# EAGLE design Gimbal Controller Board (EAGLE 8.4.1)

## Sheet 1 of 2
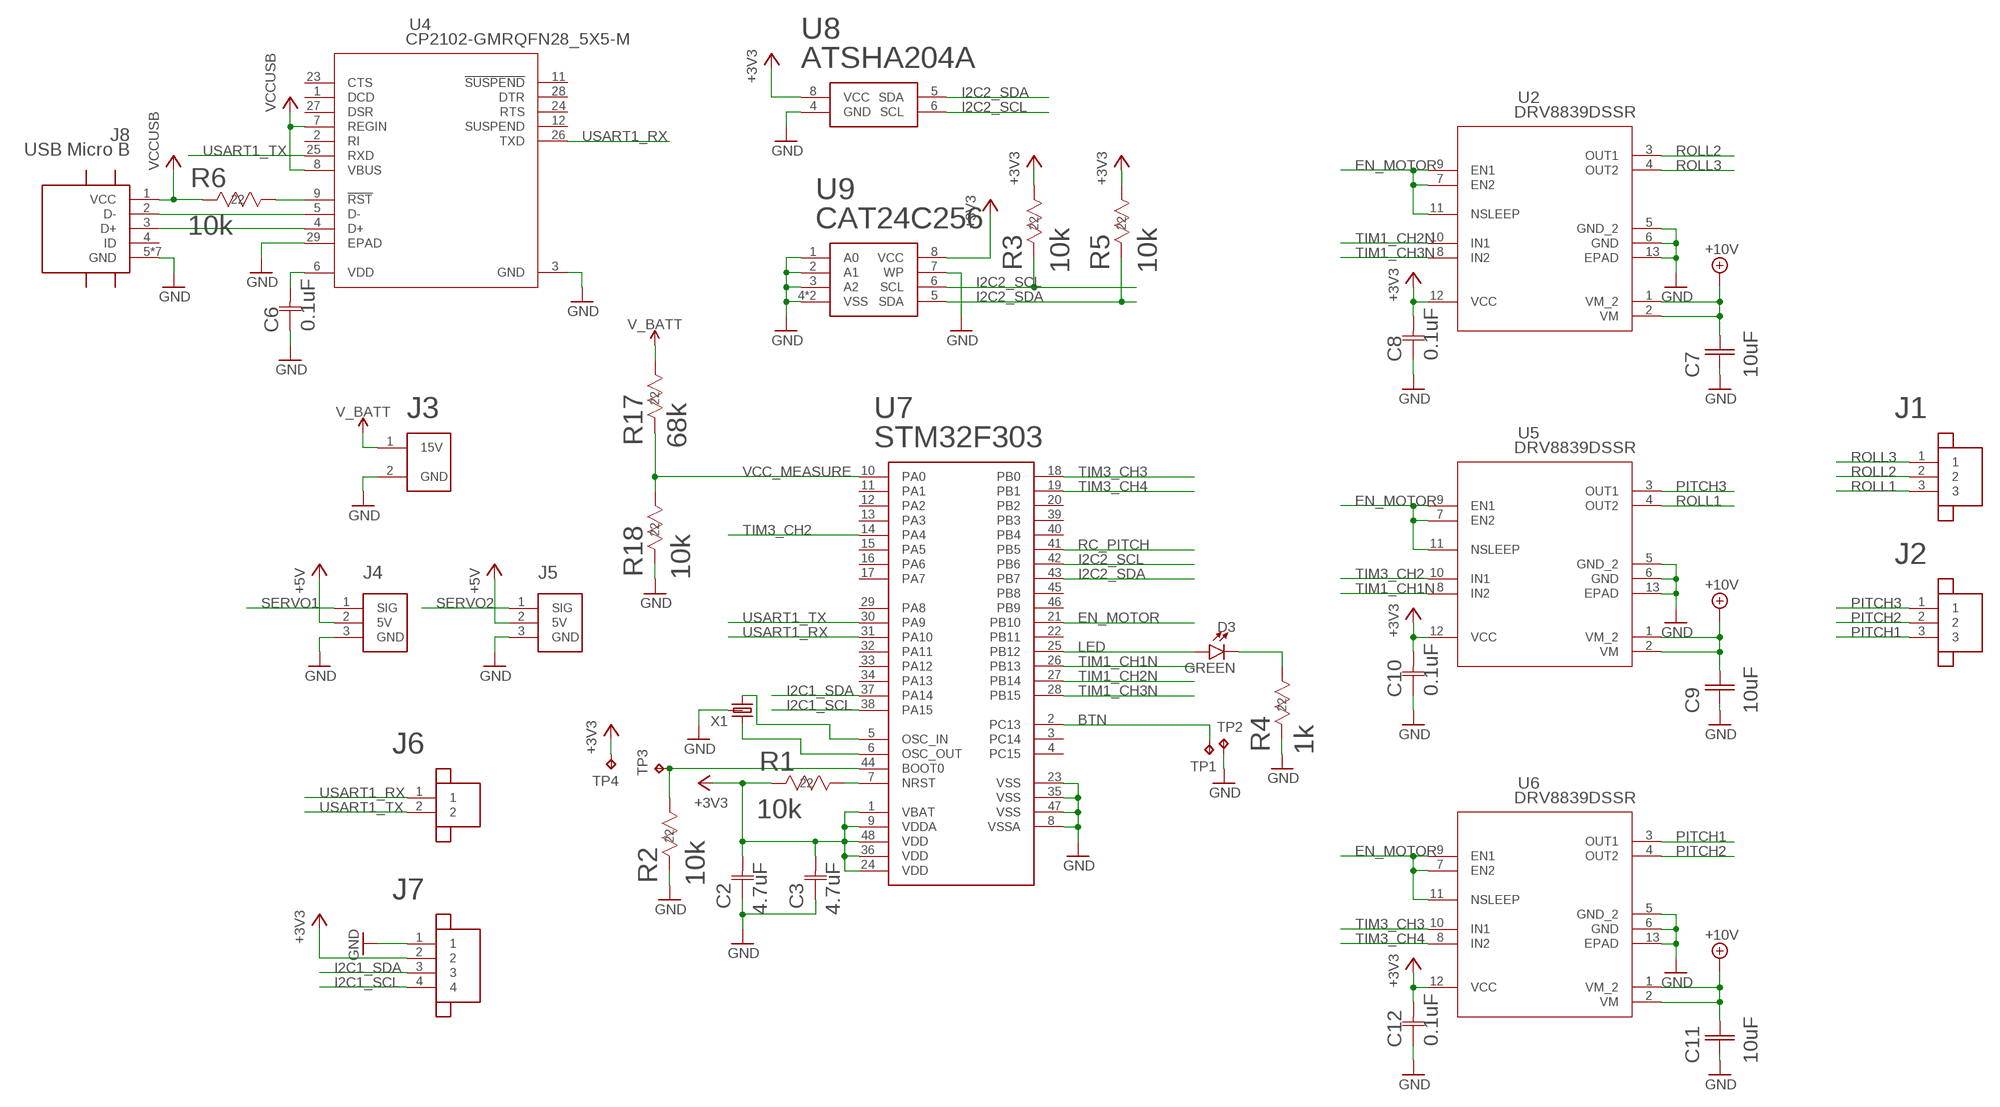
[diagram p0: schematic, sheet 1]

### Parts
C2  4.7uF  06036D475KAT2A0603-M  [0603-M]
C3  4.7uF  06036D475KAT2A0603-M  [0603-M]
C6  0.1uF  0402ZD104KAT2A0402-M  [0402-M]
C7  10uF  10UF_CAPACITOR  [0805_CAPACITOR]
C8  0.1uF  0402ZD104KAT2A0402-M  [0402-M]
C9  10uF  10UF_CAPACITOR  [0805_CAPACITOR]
C10  0.1uF  0402ZD104KAT2A0402-M  [0402-M]
C11  10uF  10UF_CAPACITOR  [0805_CAPACITOR]
C12  0.1uF  0402ZD104KAT2A0402-M  [0402-M]
D3  GREEN  LED-GREEN0603  [LED-0603]
J1  JST_SH_3POS  [JST_SH_3POS]
J2  JST_SH_3POS  [JST_SH_3POS]
J3  GIMBAL_POWER_CONNECTOR  [XH_CONNECTOR]
J4  SERVO_CONNECTOR  [SERVO_CONNECTOR]
J5  SERVO_CONNECTOR  [SERVO_CONNECTOR]
J6  JST_SH_2POS  [JST_SH_2POS]
J7  JST_SH_4POS  [JST_SH_4POS]
J8  USB_MICRO_B_SMT  [USB_MICRO_B_SMT]
R1  10k  ERA-6AEB103V  [RC0805N]
R2  10k  ERA-6AEB103V  [RC0805N]
R3  10k  ERA-6AEB103V  [RC0805N]
R4  1k  RC0603JR-071KLRC0603N-M  [RC0603N-M]
R5  10k  ERA-6AEB103V  [RC0805N]
R6  10k  ERA-6AEB103V  [RC0805N]
R17  68k  RC0402FR-0768KLRC0402N-M  [RC0402N-M]
R18  10k  ERA-6AEB103V  [RC0805N]
TP1  TPB2,54  [B2,54]
TP2  TPB2,54  [B2,54]
TP3  TPB2,54  [B2,54]
TP4  TPB2,54  [B2,54]
U2  DRV8839DSSR  [DSS12_P9X2]
U4  CP2102-GMRQFN28_5X5-M  [QFN28_5X5-M]
U5  DRV8839DSSR  [DSS12_P9X2]
U6  DRV8839DSSR  [DSS12_P9X2]
U7  STM32F303  [LQFP48]
U8  ATSHA204A  [UDFN8_3X2]
U9  CAT24C256  [UDFN8_3X2]
X1  CSTCE8M00G55Z  [3-SMD]

### Nets
+3V3: C2.2 C3.2 C8.2 C10.2 C12.2 J7.2 R1.2 R3.1 R5.1 TP4.TP U2.12(VCC) U5.12(VCC) U6.12(VCC) U7.1(VBAT) U7.9(VDDA) U7.24(VDD) U7.36(VDD) U7.48(VDD) U8.8(VCC) U9.8(VCC) ; also sheet 2
+5V: J4.2(5V) J5.2(5V) ; also sheet 2
+10V: C7.2 C9.2 C11.2 U2.1(VM_2) U2.2(VM) U5.1(VM_2) U5.2(VM) U6.1(VM_2) U6.2(VM) ; also sheet 2
BTN: TP1.TP U7.2(PC13)
EN_MOTOR: U2.7(EN2) U2.9(EN1) U2.11(NSLEEP) U5.7(EN2) U5.9(EN1) U5.11(NSLEEP) U6.7(EN2) U6.9(EN1) U6.11(NSLEEP) U7.21(PB10)
GND: C2.1 C3.1 C6.1 C7.1 C8.1 C9.1 C10.1 C11.1 C12.1 J3.2(GND) J4.3(GND) J5.3(GND) J7.1 J8.5(GND) J8.6(GND) J8.7(GND) J8.P$1(GND) J8.P$2(GND) J8.P$3(GND) J8.P$4(GND) R2.2 R4.2 R18.2 TP2.TP U2.5(GND_2) U2.6(GND) U2.13(EPAD) U4.3(GND) U4.29(EPAD) U5.5(GND_2) U5.6(GND) U5.13(EPAD) U6.5(GND_2) U6.6(GND) U6.13(EPAD) U7.8(VSSA) U7.23(VSS) U7.35(VSS) U7.47(VSS) U8.4(GND) U9.1(A0) U9.2(A1) U9.3(A2) U9.4(VSS) U9.7(WP) U9.9(VSS) X1.2(GND) ; also sheet 2
I2C1_SCL: J7.4 U7.38(PA15)
I2C1_SDA: J7.3 U7.37(PA14)
I2C2_SCL: R3.2 U7.42(PB6) U8.6(SCL) U9.6(SCL)
I2C2_SDA: R5.2 U7.43(PB7) U8.5(SDA) U9.5(SDA)
LED: D3.A U7.25(PB12)
N$2: U7.5(OSC_IN) X1.3
N$4: R1.1 U7.7(NRST)
N$5: D3.C R4.1
N$6: R2.1 TP3.TP U7.44(BOOT0)
N$7: J8.2(D-) U4.5(D-)
N$8: J8.3(D+) U4.4(D+)
N$9: R6.1 U4.9(!RST)
N$10: C6.2 U4.6(VDD)
N$24: U7.6(OSC_OUT) X1.1
P$1: J8.1(VCC) R6.2 U4.7(REGIN) U4.8(VBUS) ; supply symbol labelled VCCUSB
PITCH1: J2.3 U6.3(OUT1)
PITCH2: J2.2 U6.4(OUT2)
PITCH3: J2.1 U5.3(OUT1)
RC_PITCH: U7.41(PB5)
ROLL1: J1.3 U5.4(OUT2)
ROLL2: J1.2 U2.3(OUT1)
ROLL3: J1.1 U2.4(OUT2)
SERVO1: J4.1(SIG)
SERVO2: J5.1(SIG)
TIM1_CH1N: U5.8(IN2) U7.26(PB13)
TIM1_CH2N: U2.10(IN1) U7.27(PB14)
TIM1_CH3N: U2.8(IN2) U7.28(PB15)
TIM3_CH2: U5.10(IN1) U7.14(PA4)
TIM3_CH3: U6.10(IN1) U7.18(PB0)
TIM3_CH4: U6.8(IN2) U7.19(PB1)
USART1_RX: J6.1 U4.26(TXD) U7.31(PA10)
USART1_TX: J6.2 U4.25(RXD) U7.30(PA9)
V_BATT: J3.1(15V) R17.1 ; also sheet 2
VCC_MEASURE: R17.2 R18.1 U7.10(PA0)
Unconnected: J8.4(ID) U4.1(DCD) U4.2(RI) U4.11(!SUSPEND) U4.12(SUSPEND) U4.23(CTS) U4.24(RTS) U4.27(DSR) U4.28(DTR) U7.3(PC14) U7.4(PC15) U7.11(PA1) U7.12(PA2) U7.13(PA3) U7.15(PA5) U7.16(PA6) U7.17(PA7) U7.20(PB2) U7.22(PB11) U7.29(PA8) U7.32(PA11) U7.33(PA12) U7.34(PA13) U7.39(PB3) U7.40(PB4) U7.45(PB8) U7.46(PB9)

## Sheet 2 of 2
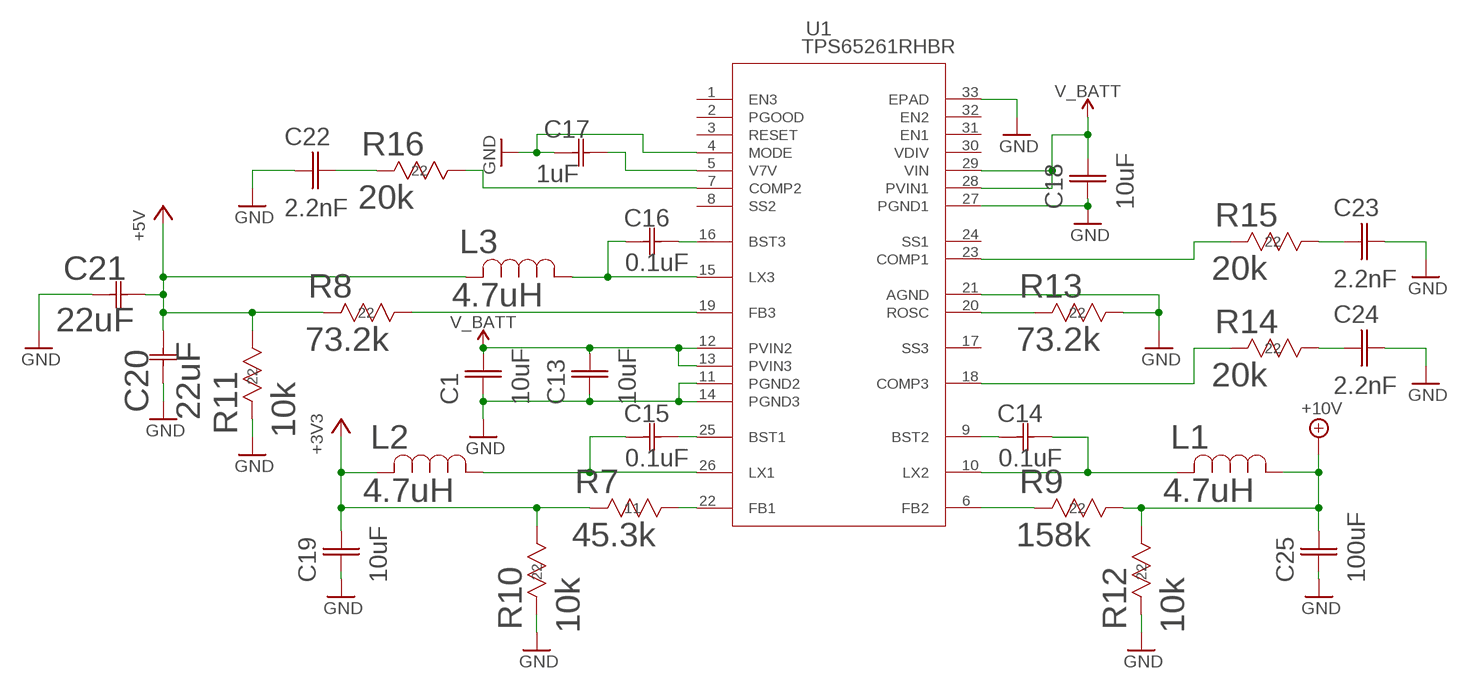
[diagram p1: schematic, sheet 2]

### Parts
C1  10uF  10UF_CAPACITOR  [0805_CAPACITOR]
C13  10uF  10UF_CAPACITOR  [0805_CAPACITOR]
C14  0.1uF  0402ZD104KAT2A0402-M  [0402-M]
C15  0.1uF  0402ZD104KAT2A0402-M  [0402-M]
C16  0.1uF  0402ZD104KAT2A0402-M  [0402-M]
C17  1uF  CC0805KKX7R7BB105  [YAG_CC0805]
C18  10uF  10UF_CAPACITOR  [0805_CAPACITOR]
C19  10uF  10UF_CAPACITOR  [0805_CAPACITOR]
C20  22uF  GRM21BR60J226ME39L  [G-21]
C21  22uF  GRM21BR60J226ME39L  [G-21]
C22  2.2nF  2200PF_CAPACITOR  [0402_CAPACITOR]
C23  2.2nF  2200PF_CAPACITOR  [0402_CAPACITOR]
C24  2.2nF  2200PF_CAPACITOR  [0402_CAPACITOR]
C25  100uF  100UF_CER_CAPACITOR  [1210_CAPACITOR]
L1  4.7uH  DFE252012P-4R7M=P2"  [1008]
L2  4.7uH  DFE252012P-4R7M=P2"  [1008]
L3  4.7uH  DFE252012P-4R7M=P2"  [1008]
R7  45.3k  RMCF0402FT73K2STA_RMCF0402-M  [STA_RMCF0402-M]
R8  73.2k  RC0402FR-0745K3LRC0402N-M  [RC0402N-M]
R9  158k  RC0402FR-07150KLRC0402N-M  [RC0402N-M]
R10  10k  ERA-6AEB103V  [RC0805N]
R11  10k  ERA-6AEB103V  [RC0805N]
R12  10k  ERA-6AEB103V  [RC0805N]
R13  73.2k  RC0402FR-0745K3LRC0402N-M  [RC0402N-M]
R14  20k  RC0402FR-0720KLRC0402N-M  [RC0402N-M]
R15  20k  RC0402FR-0720KLRC0402N-M  [RC0402N-M]
R16  20k  RC0402FR-0720KLRC0402N-M  [RC0402N-M]
U1  TPS65261RHBR  [RHB32_3P45X3P45]

### Nets
+3V3: C19.2 L2.P$2 R7.1 R10.1 ; also sheet 1
+5V: C20.2 C21.2 L3.P$2 R8.2 R11.1 ; also sheet 1
+10V: C25.2 L1.P$1 R9.1 R12.1 ; also sheet 1
GND: C1.1 C13.1 C17.1 C18.1 C19.1 C20.1 C21.1 C22.1 C23.2 C24.2 C25.1 R10.2 R11.2 R12.2 R13.1 U1.4(MODE) U1.11(PGND2) U1.14(PGND3) U1.21(AGND) U1.27(PGND1) U1.33(EPAD) ; also sheet 1
N$1: C16.2 U1.16(BST3)
N$3: R8.1 U1.19(FB3)
N$11: C14.1 U1.9(BST2)
N$12: R14.2 U1.18(COMP3)
N$13: R9.2 U1.6(FB2)
N$14: R13.2 U1.20(ROSC)
N$15: C15.1 L2.P$1 U1.26(LX1)
N$16: C15.2 U1.25(BST1)
N$17: R7.2 U1.22(FB1)
N$18: C24.1 R14.1
N$19: C16.1 L3.P$1 U1.15(LX3)
N$20: C14.2 L1.P$2 U1.10(LX2)
N$23: C17.2 U1.5(V7V)
N$26: R16.1 U1.7(COMP2)
N$27: C22.2 R16.2
N$28: R15.2 U1.23(COMP1)
N$29: C23.1 R15.1
V_BATT: C1.2 C13.2 C18.2 U1.12(PVIN2) U1.13(PVIN3) U1.28(PVIN1) U1.29(VIN) ; also sheet 1
Unconnected: U1.1(EN3) U1.2(PGOOD) U1.3(RESET) U1.8(SS2) U1.17(SS3) U1.24(SS1) U1.30(VDIV) U1.31(EN1) U1.32(EN2)

## Library data of the parts
C1 C7 C9 C11 C13 C18 C19 = thanics_robotics:10UF_CAPACITOR
C2 C3 = 4.7uF-capacitor:06036D475KAT2A; MANUFACTURER_PART_NUMBER: 06036D475KAT2A; VENDOR: AVX Corporation
C6 C8 C10 C12 C14-C16 = 0.1uF-capacitor-0402:0402ZD104KAT2A; MANUFACTURER_PART_NUMBER: 0402ZD104KAT2A; VENDOR: AVX Corporation
C17 = 1uF X7R Ceramic Capacitor:CC0805KKX7R7BB105; COPYRIGHT: Copyright C 2015 Accelerated Designs. All rights reserved; MANUFACTURER_PART_NUMBER: CC0805KKX7R7BB105; VENDOR: Vendor
C20 C21 = 22uF X5R Ceramic Capacitor:GRM21BR60J226ME39L; COPYRIGHT: Copyright C 2015 Accelerated Designs. All rights reserved; MANUFACTURER_PART_NUMBER: GRM21BR60J226ME39L; VENDOR: Vendor
C22-C24 = thanics_robotics:2200PF_CAPACITOR
C25 = thanics_robotics:100UF_CER_CAPACITOR
D3 = Controller Board:LED-GREEN: Green SMD LED Used in manufacturing of various products at SparkFun Packages: 0603 - SMD 0603 package [Product Link] <http://www.futureelectronics.com/en/technologies/semiconductors/optoelectronics/leds/Pages/9894312-LTST-C190GKT.aspx?CrossPart=HSMG-C190&IM=0> LilyPad 1206 - SMD1206 LilyPad package [Product Link] <http://www.futureelectronics.com/en/Technologies/Product.aspx?ProductID=IN150NGHARVATEKCORPORATION2049943&IM=0> 1206 - SMD1206 package [Product Link] <http://www.futureelectronics.com/en/technologies/semiconductors/optoelectronics/leds/Pages/8315665-LTST-C150KGKT.aspx?IM=0> 1206 Bottom Mount -SMD 1206 Bottom Mount [Product Link] <http://www.digikey.com/product-detail/en/lite-on-inc/LTST-C230KGKT/160-1456-1-ND/386854> SparkFun Products: Pro Mini 328 -5V <https://www.sparkfun.com/products/821> RedBoard <https://www.sparkfun.com/products/12757> MP3 Trigger <https://www.sparkfun.com/products/13720> Makey Makey <https://www.sparkfun.com/products/11076>; PROD_ID: DIO-00821
J1 J2 = thanics_robotics:JST_SH_3POS
J3 = thanics_robotics:GIMBAL_POWER_CONNECTOR
J4 J5 = thanics_robotics:SERVO_CONNECTOR
J6 = thanics_robotics:JST_SH_2POS
J7 = thanics_robotics:JST_SH_4POS
J8 = thanics_robotics:USB_MICRO_B_SMT
L1-L3 = 4.7uH-inductor:DFE252012P-4R7M=P2
R1-R3 R5 R6 R10-R12 R18 = 10k-resistor:ERA-6AEB103V; CASE: 0805 2012 metric; COMPOSITION: Thin Film; COPYRIGHT: Copyright C 2015 Accelerated Designs. All rights reserved; DATASHEET: httpindustrial.panasonic.comwwwcgijvcr13pz.cgi?E+PZ+3+AOA0026+ERA6AEB103V+7+WW; DIGIKEYPARTNUMBER: P10KDATRND; HEIGHT: 0.024" 0.60mm; LEADSTYLE: Surface Mount SMD SMT; MANUFACTURER_PART_NUMBER: ERA6AEB103V; NUMBEROFTERMINATIONS: 2; PACKAGECASE: 0805 2012 Metric; PACKAGING: Tape &amp Reel TR; POWERWATTS: 0.125W 18W; QUANTITY_AVAILABLE: 225000; RESISTANCEINOHMS: 10.0K; RESISTANCEOHMS: 10K; SIZEDIMENSION: 0.079" L x 0.049" W 2.00mm x 1.25mm; TEMPERATURECOEFFICIENT: 25ppm°C; TOLERANCE: 0.1%; VENDOR: Panasonic; VOLTAGEWORKING: 100V
R4 = 1k-resistor:RC0603JR-071KL; CASE: 0603 1608 metric; COMPOSITION: Thick Film; COPYRIGHT: Copyright C 2015 Accelerated Designs. All rights reserved; DATASHEET: httpwww.yageo.comdocumentsrecentPYuRC0603_51_RoHS_L_4.pdf; DESCRIPTION: RES 1.0K OHM 110W 5% 0603 SMD; DIGIKEYPARTNUMBER: 3111.0KGRTRND; HEIGHT: 0.022" 0.55mm; LEADSTYLE: Surface Mount SMD SMT; MANUFACTURER_PART_NUMBER: RC0603JR071KL; NEWARKPARTNUMBER: 14M7231; NUMBEROFTERMINATIONS: 2; PACKAGECASE: 0603 1608 Metric; PACKAGING: Tape &amp Reel TR; POWERWATTS: 0.1W 110W; QUANTITY_AVAILABLE: 0; RESISTANCEINOHMS: 1.00K; RESISTANCEOHMS: 1K; SIZEDIMENSION: 0.063" L x 0.031" W 1.60mm x 0.80mm; TEMPERATURECOEFFICIENT: 100ppm°C; TOLERANCE: 5%; VENDOR: Yageo; VOLTAGEWORKING: 50V
R7 = 73.2k-resistor:RMCF0402FT73K2; MANUFACTURER_PART_NUMBER: RMCF0402FT73K2; VENDOR: Stackpole International
R8 R13 = 45.3k-resistor:RC0402FR-0745K3L; MANUFACTURER_PART_NUMBER: RC0402FR0745K3L; VENDOR: Yageo
R9 = 158k-resistor:RC0402FR-07150KL; MANUFACTURER_PART_NUMBER: RC0402FR07150KL; VENDOR: Yageo
R14-R16 = 20k-resistor:RC0402FR-0720KL; MANUFACTURER_PART_NUMBER: RC0402FR0720KL; VENDOR: Yageo
R17 = 68k-resistor:RC0402FR-0768KL; MANUFACTURER_PART_NUMBER: RC0402FR0768KL; VENDOR: Yageo
TP1-TP4 = testpad:TP: Test pad
U1 = tps65261:TPS65261RHBR; MANUFACTURER_PART_NUMBER: TPS65261RHBR; VENDOR: Texas Instruments
U2 U5 U6 = drv8839:DRV8839DSSR; MANUFACTURER_PART_NUMBER: DRV8839DSSR; VENDOR: Texas Instruments
U4 = cp2102n:CP2102-GMR; MANUFACTURER_PART_NUMBER: CP2102GMR; VENDOR: Silicon Labs
U7 = thanics_robotics:STM32F303
U8 = thanics_robotics:ATSHA204A
U9 = thanics_robotics:CAT24C256
X1 = thanics_robotics:CSTCE8M00G55Z

## Board
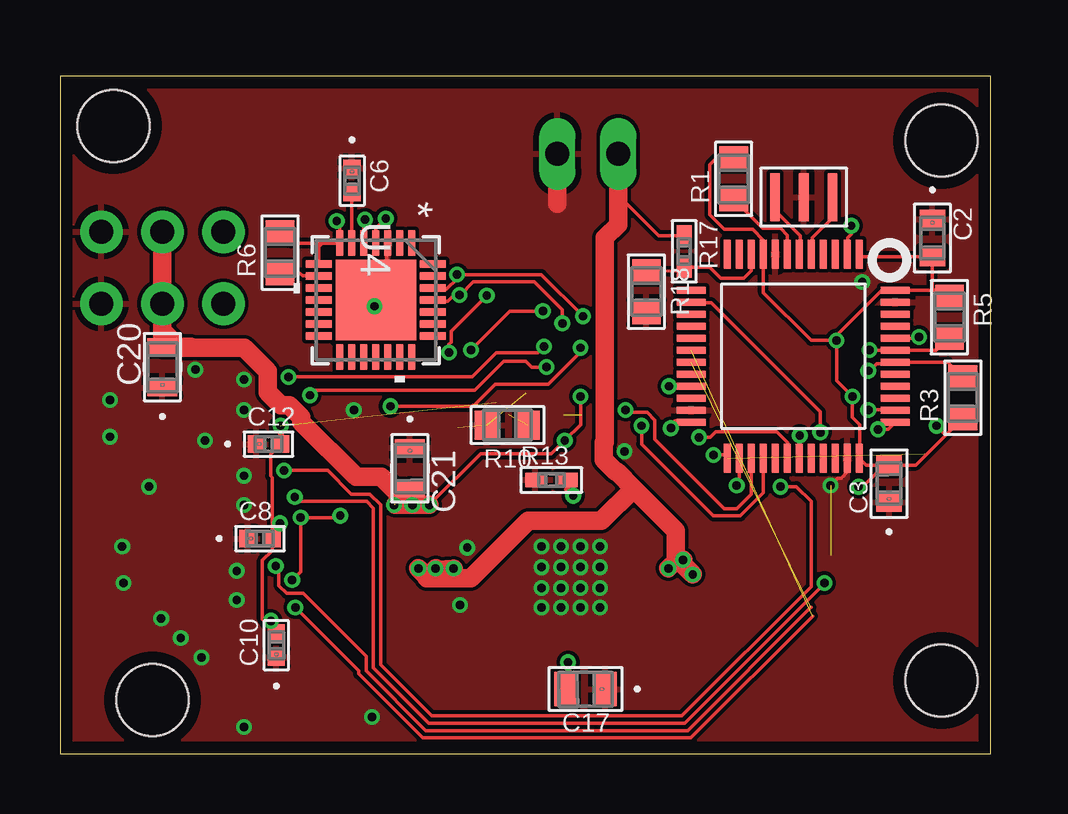
[diagram p2: board, top side]
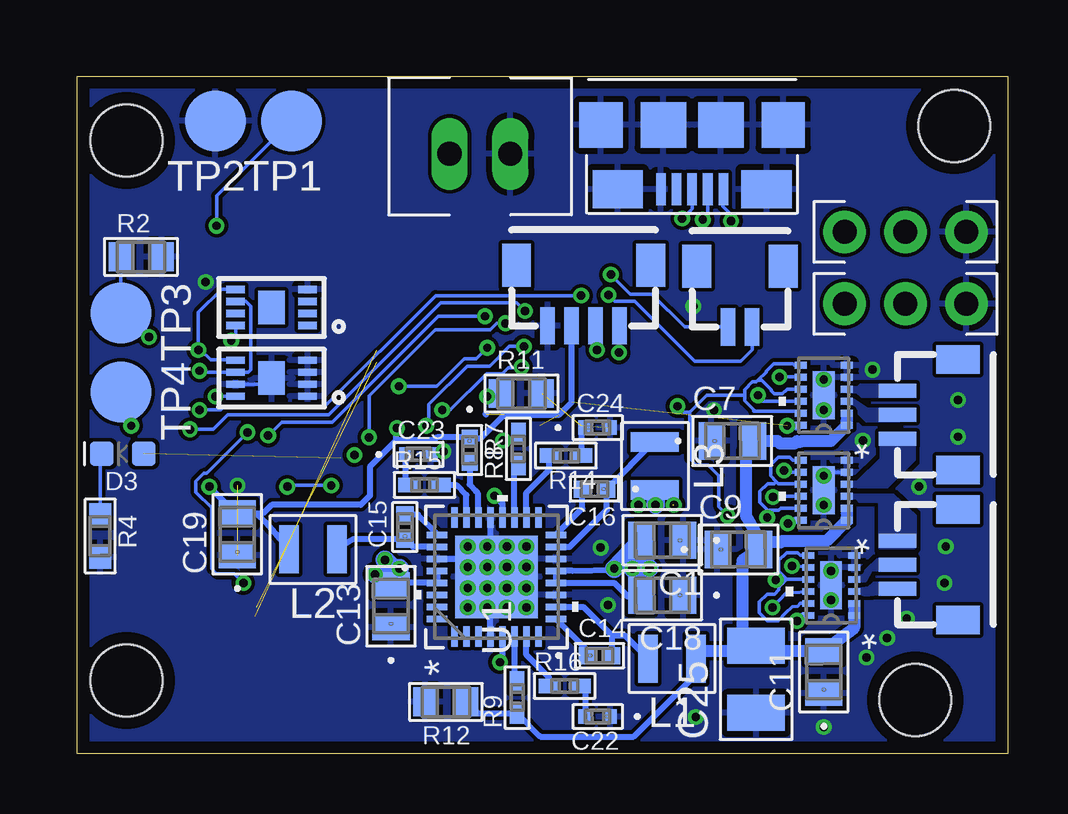
[diagram p3: board, bottom side, seen from below]

Size 38.79 x 28.23 mm. Coordinates in mm from the lower left corner, seen from the top.
Outline: 0,0 38.79,0 38.79,28.24 0,28.24 0,0
Copper layers (1*16): Top 0.035mm / dielectric 1.6mm / Bottom 0.035mm
Design rules "Elecrow_2-layer_PCB_eagle_rule": minimum track width 6mil, minimum drill 12mil, track to track 6mil, track to pad 6mil, pad to pad 6mil, via to via 8mil, smd to smd 0mil, copper to edge 20mil, drill to drill 10mil, minimum pad ring 6mil, minimum via ring 6mil, stop-mask expansion 0mil, vias tented up to drill 100mil, thermal gap 10mil
Holes 3 mm at 3.86,2.24 36.73,3.05 36.73,25.55 2.24,26.16

### Footprints (pad centres in the part's own frame; a part is rotated, then mirrored left to right if it is on the bottom)
0805_CAPACITOR = smd 1.067 x 1.549: 1 -0.876,0; 2 0.876,0
0603-M = smd 0.813 x 1.067: 1 -0.775,0; 2 0.775,0
0402-M = smd 0.711 x 0.711: 1 -0.508,0; 2 0.508,0
YAG_CC0805 = smd 0.965 x 1.448: 1 -0.826,0; 2 0.826,0
G-21 = smd 0.711 x 1.245: 1 -0.851,0; 2 0.851,0
0402_CAPACITOR = smd 0.559 x 0.61: 1 -0.521,0; 2 0.521,0
1210_CAPACITOR = smd 1.5 x 2.4: 1 -1.4,0; 2 1.4,0
LED-0603 = smd 1 x 1: A -0.877,0; C 0.877,0
JST_SH_3POS = smd 0.6 x 1.55: 1 -1.61,-0.08; 2 -0.61,-0.08; 3 0.39,-0.08 | smd 1.2 x 1.8: P$5 -2.91,2.445; P$6 1.69,2.445
XH_CONNECTOR = drill 1.001 long: 1 -1.27,0; 2 1.27,0
SERVO_CONNECTOR = drill 1 pad 1.778: 1 0,2.54; 2 0,0; 3 0,-2.54
JST_SH_2POS = smd 0.6 x 1.55: 1 -1.5,0; 2 -0.5,0 | smd 1.2 x 1.8: P$5 -2.8,2.525; P$6 0.8,2.525
JST_SH_4POS = smd 0.6 x 1.55: 1 -1.5,0; 2 -0.5,0; 3 0.5,0; 4 1.5,0 | smd 1.2 x 1.8: P$5 -2.8,2.525; P$6 2.8,2.525
USB_MICRO_B_SMT = smd 0.4 x 1.35: 1 -1.3,0; 2 -0.65,0; 3 0,0; 4 0.65,0; 5 1.3,0 | smd 1.9 x 1.9: 6 -1.2,-2.68; 7 1.2,-2.68 | smd 2.1 x 1.6: P$1 -3.1,0; P$2 3.1,0 | smd 1.8 x 1.9: P$3 3.8,-2.68; P$4 -3.8,-2.68
1008 = smd 0.8 x 2: P$1 -1,0; P$2 1,0
RC0805N = smd 1.006 x 1.2: 1 -0.853,0; 2 0.853,0
RC0603N-M = smd 0.965 x 0.914: 1 -0.876,0; 2 0.876,0
STA_RMCF0402-M = smd 0.711 x 0.66: 1 -0.495,0; 2 0.495,0
RC0402N-M = smd 0.864 x 0.61: 1 -0.66,0; 2 0.66,0
B2,54 = smd 2.54 x 2.54: TP 0,0
RHB32_3P45X3P45 = smd 0.85 x 0.28: 1 -2.475,1.75; 2 -2.475,1.25; 3 -2.475,0.75; 4 -2.475,0.25; 5 -2.475,-0.25; 6 -2.475,-0.75; 7 -2.475,-1.25; 8 -2.475,-1.75; 17 2.475,-1.75; 18 2.475,-1.25; 19 2.475,-0.75; 20 2.475,-0.25; 21 2.475,0.25; 22 2.475,0.75; 23 2.475,1.25; 24 2.475,1.75 | smd 0.28 x 0.85: 9 -1.75,-2.475; 10 -1.25,-2.475; 11 -0.75,-2.475; 12 -0.25,-2.475; 13 0.25,-2.475; 14 0.75,-2.475; 15 1.25,-2.475; 16 1.75,-2.475; 25 1.75,2.475; 26 1.25,2.475; 27 0.75,2.475; 28 0.25,2.475; 29 -0.25,2.475; 30 -0.75,2.475; 31 -1.25,2.475; 32 -1.75,2.475 | smd 3.45 x 3.45: 33 0,0
DSS12_P9X2 = smd 0.5 x 0.28: 1 -0.959,1.25; 2 -0.959,0.75; 3 -0.959,0.25; 4 -0.959,-0.25; 5 -0.959,-0.75; 6 -0.959,-1.25; 7 0.959,-1.25; 8 0.959,-0.75; 9 0.959,-0.25; 10 0.959,0.25; 11 0.959,0.75; 12 0.959,1.25 | smd 0.9 x 2: 13 0,0
QFN28_5X5-M = smd 1.067 x 0.305: 1 -2.375,1.5; 2 -2.375,1; 3 -2.375,0.5; 4 -2.375,0; 5 -2.375,-0.5; 6 -2.375,-1; 7 -2.375,-1.5; 15 2.375,-1.5; 16 2.375,-1; 17 2.375,-0.5; 18 2.375,0; 19 2.375,0.5; 20 2.375,1; 21 2.375,1.5 | smd 0.305 x 1.067: 8 -1.5,-2.375; 9 -1,-2.375; 10 -0.5,-2.375; 11 0,-2.375; 12 0.5,-2.375; 13 1,-2.375; 14 1.5,-2.375; 22 1.5,2.375; 23 1,2.375; 24 0.5,2.375; 25 0,2.375; 26 -0.5,2.375; 27 -1,2.375; 28 -1.5,2.375 | smd 3.353 x 3.353: 29 0,0
LQFP48 = smd 0.3 x 1.2: 1 -2.75,-4.25; 2 -2.25,-4.25; 3 -1.75,-4.25; 4 -1.25,-4.25; 5 -0.75,-4.25; 6 -0.25,-4.25; 7 0.25,-4.25; 8 0.75,-4.25; 9 1.25,-4.25; 10 1.75,-4.25; 11 2.25,-4.25; 12 2.75,-4.25; 25 2.75,4.25; 26 2.25,4.25; 27 1.75,4.25; 28 1.25,4.25; 29 0.75,4.25; 30 0.25,4.25; 31 -0.25,4.25; 32 -0.75,4.25; 33 -1.25,4.25; 34 -1.75,4.25; 35 -2.25,4.25; 36 -2.75,4.25 | smd 1.2 x 0.3: 13 4.25,-2.75; 14 4.25,-2.25; 15 4.25,-1.75; 16 4.25,-1.25; 17 4.25,-0.75; 18 4.25,-0.25; 19 4.25,0.25; 20 4.25,0.75; 21 4.25,1.25; 22 4.25,1.75; 23 4.25,2.25; 24 4.25,2.75; 37 -4.25,2.75; 38 -4.25,2.25; 39 -4.25,1.75; 40 -4.25,1.25; 41 -4.25,0.75; 42 -4.25,0.25; 43 -4.25,-0.25; 44 -4.25,-0.75; 45 -4.25,-1.25; 46 -4.25,-1.75; 47 -4.25,-2.25; 48 -4.25,-2.75
UDFN8_3X2 = smd 0.78 x 0.3: 1 -1.5,0.75; 2 -1.5,0.25; 3 -1.5,-0.25; 4 -1.5,-0.75; 5 1.5,-0.75; 6 1.5,-0.25; 7 1.5,0.25; 8 1.5,0.75 | smd 1.1 x 1.4: 9 0,0
3-SMD = smd 0.4 x 2: 1 1.2,0; 2 0,0; 3 -1.2,0

### Placement (x,y rotation side)
C1  14.4,8.89 180 bottom
C2  36.35,21.49 270 top
C3  34.54,11.25 90 top
C6  12.17,23.88 270 top
C7  11.48,13.03 0 bottom
C8  8.33,8.97 0 top
C9  11.23,8.51 0 bottom
C10  9.02,4.52 90 top
C11  7.67,3.4 90 bottom
C12  8.69,12.9 0 top
C13  25.7,6.15 90 bottom
C14  17.02,4.09 0 bottom
C15  25.12,9.45 90 bottom
C16  17.22,11.02 180 bottom
C17  21.89,2.69 180 top
C18  14.4,6.6 180 bottom
C19  32.11,9.14 90 bottom
C20  4.27,16.1 90 top
C21  14.58,11.89 270 top
C22  17.09,1.55 180 bottom
C23  24.56,12.47 0 bottom
C24  17.09,13.59 0 bottom
C25  10.49,3.1 90 bottom
D3  36.88,12.5 180 bottom
J1  4.52,13.51 270 bottom
J2  4.52,7.26 270 bottom
J3  22,24.99 0 bottom
J4  4.27,18.75 90 bottom
J5  4.27,21.74 90 bottom
J6  10.16,17.78 0 bottom
J7  17.68,17.83 0 bottom
J8  13.16,23.52 180 bottom
L1  14,3.96 180 bottom
L2  28.96,8.51 180 bottom
L3  14.71,11.99 270 bottom
R1  28.07,23.95 90 top
R2  36.12,20.7 0 bottom
R3  37.62,14.83 90 top
R4  37.82,9.07 270 bottom
R5  37.06,18.19 270 top
R6  9.17,20.88 90 top
R7  22.43,12.65 270 bottom
R8  20.4,12.7 90 bottom
R9  20.45,2.34 90 bottom
R10  18.64,13.69 180 top
R11  20.27,15.01 0 bottom
R12  23.42,2.16 180 bottom
R13  20.47,11.4 0 top
R14  18.41,12.42 180 bottom
R15  24.31,11.2 0 bottom
R16  18.47,2.82 0 bottom
R17  26.01,20.93 270 top
R18  24.43,19.25 270 top
TP1  29.84,26.37 180 bottom
TP2  33.02,26.37 180 bottom
TP3  36.96,18.36 270 bottom
TP4  36.96,15.06 270 bottom
U1  21.31,7.37 90 bottom
U2  7.67,14.94 180 bottom
U4  13.16,18.9 270 top
U5  7.67,10.97 180 bottom
U6  7.37,7.01 180 bottom
U7  30.56,16.56 180 top
U8  30.68,18.59 180 bottom
U9  30.68,15.65 180 bottom
X1  30.99,23.19 180 top

### Tracks (layer width: path | path; a pad name or v marks a point on that pad's centre or on a via)
+3V3  (via drill 0.35)  (3 unrouted)
  Top 0.152: 34.34,12.03 C3.2 35.66,12.03 36.91,13.28 | 34.34,12.03 33.59,12.03 U7.36 33.33,12.33 33.33,13.71 33.02,14.01 v33.02,14.88 32.36,15.55 v32.36,17.22 | v33.27,11.13 33.44,11.13 34.34,12.03 | 36.91,13.28 R3.1 | 36.91,13.28 | 36.91,13.28 v36.52,13.67 | 36.43,19.31 U7.48 34.23,19.31 32.36,17.44 v32.36,17.22 | 36.43,19.31 36.35,19.4 C2.2 33.4,20.71 U7.1 | v32.36,17.22 31.29,17.22 29.31,19.2 U7.9 29.31,21.39 28.85,21.84 27.69,21.84 27.08,22.45 27.08,24.54 27.34,24.81 R1.2 | 36.43,19.31 36.79,19.31 R5.1 | 26.42,13.81 U7.24 | C10.2 8.44,5.61 8.44,8.05 8.84,8.46 C8.2 8.84,11.51 8.77,11.57 8.77,12.48 C12.2
  Top 0.254: v8.79,5.54 9.09,5.11 C10.2 | C8.2 v9.17,9.6 | v9.2,13.67 C12.2 | v25.45,13.56 25.45,13.61 25.65,13.82 26.41,13.82 26.42,13.81
  Bottom 0.152: v32.36,17.22 32.18,17.4 U8.8 | v36.52,13.67 36.52,14.63 TP4.TP | v33.02,14.88 32.2,14.88 U9.8
  Bottom 0.254: U6.12 8.56,5.76 v8.79,5.54 | U5.12 9.04,9.72 v9.17,9.6 | U2.12 8.75,13.56 v9.2,13.67 | L2.P$2 30.91,9.63 31.29,10.01 32.09,10.01 C19.2 | C19.2 32.17,10.02 v33.27,11.13 | 25.48,13.06 23.92,13.06 23.77,13.21 22.48,13.21 22.43,13.26 R7.1 21.97,13.14 20.98,14.13 18.68,14.13 18.18,14.64 J7.2 | 25.48,13.06 26.58,11.95 26.58,10.76 26.98,10.36 30.68,10.36 31.03,10.02 C19.2 | 21.76,14.15 21.74,14.13 | 25.48,13.06 25.48,13.54 v25.45,13.56
+5V  (via drill 0.35)  (1 unrouted)
  Top 0.152: v15.39,10.36 17.53,12.5 20.47,12.5 v21.03,13.06 21.69,13.72 v21.69,14.88
  Top 0.762: v15.39,10.36 v14.68,10.36 13.97,10.36 14.08,10.48 14.08,10.7 C21.2 14,10.93 13.39,11.53 12.34,11.53 10.06,13.82 10.06,14.02 9.55,14.53 9.2,14.53 8.66,15.06 8.66,15.93 7.67,16.92 5.49,16.92 | 5.49,16.92 4.98,16.92 4.27,17.63 | 4.27,17.63 J4.2 J5.2 | 5.49,16.92 5.45,16.95 C20.2 4.27,17.63
  Bottom 0.152: L3.P$2 14.77,10.99 v15.39,10.36 | 21.09,14.98 R11.1 | 21.09,14.98 21.03,14.92 | v21.69,14.88 21.6,14.98 21.09,14.98 | R8.2 20.7,13.06 v21.03,13.06
  Bottom 0.762: L3.P$2 14.68,10.81 v14.68,10.36
  other vias: 13.92,10.36
+10V
  Bottom 0.254: R12.1 22.08,1.68 R9.1 19.48,0.71 15.6,0.71 12.99,3.31 L1.P$1 | 6.71,10.01 U5.2 | 6.71,14.03 U2.2 | U6.2 6.41,6.1
  Bottom 0.508: L1.P$1 12.68,4.28 11.07,4.28 | 11.07,4.28 C11.2 6.41,5.24 U6.1 6.4,5.99 6.41,6.1 | C9.2 10.21,8.8 9.48,8.8 9.42,8.86 7.57,8.86 U5.1 | U5.1 6.71,10.01 | 6.71,9.7 U5.1 | 6.71,14.03 6.71,13.92 U2.1 7.37,13.03 8.6,13.03 8.65,12.99 8.8,13.03 8.89,12.93 9.5,12.93 9.6,13.03 C7.2 10.92,12.61 10.92,9.91 10.5,9.18 C9.2 | C9.2 11.06,8.05 11.06,7.92 11.07,7.91 11.07,4.28
  Bottom 0.762: 11.07,4.28 10.71,4.28 C25.2
BTN  (via drill 0.35)
  Top 0.152: v32.97,22 32.97,21.64 32.82,21.49 U7.2
  Bottom 0.152: TP1.TP 32.97,23.24 v32.97,22
EN_MOTOR  (via drill 0.35)
  Top 0.152: v9.68,7.24 10.03,7.59 v10.03,9.84 11.6,9.84 v11.68,9.92 | v13.77,14.48 17.15,14.48 17.19,14.52 17.26,14.52 18.14,15.39 20.34,15.39 21.69,16.75 v21.69,16.92 | U7.21 v25.38,15.31
  Bottom 0.152: U2.11 8.72,14.28 10.59,14.28 10.59,14.33 10.97,14.7 10.97,14.94 | U2.9 9.19,15.19 9.2,15.19 9.39,14.99 9.73,14.99 9.86,15.11 9.86,15.16 10.25,15.56 10.42,15.56 | U2.7 8.89,16.19 8.96,16.25 9.75,16.25 10.08,15.93 10.08,15.9 10.42,15.56 | 9.22,7.27 9.55,7.59 9.55,8.05 9.22,8.38 8.76,8.38 8.64,8.26 U6.7 | U6.9 8.33,7.27 9.22,7.27 | 9.26,7.23 9.55,6.94 9.55,6.83 9.71,6.65 10.04,6.65 10.36,6.33 10.36,5.87 10.04,5.54 9.57,5.54 9.25,5.87 8.99,6.13 8.76,6.15 8.65,6.26 U6.11 | 9.26,7.23 9.22,7.26 9.22,7.27 | 10.42,15.56 10.49,15.49 10.64,15.49 10.97,15.16 10.97,14.94 | 9.65,11.33 9.88,11.57 9.88,12.03 9.56,12.36 9.1,12.36 8.96,12.22 U5.7 | 9.65,11.33 9.56,11.25 8.65,11.25 U5.9 | 10.03,10.16 10.34,10.47 10.34,10.93 10.01,11.25 9.73,11.25 9.65,11.33 | 10.03,10.16 10.01,10.14 9.55,10.14 9.47,10.22 U5.11 | 10.03,10.16 v10.03,9.84 | v9.68,7.24 v9.66,7.23 9.26,7.23 | v11.68,9.92 12.04,10.28 12.04,11.58 12.48,12.03 12.98,12.03 13.26,12.3 13.26,14.22 | 13.26,14.22 12.55,14.94 10.97,14.94 | 13.26,14.22 13.51,14.22 v13.77,14.48 | v25.38,15.31 23.8,15.31 22.66,16.45 22.16,16.45 v21.69,16.92
GND  (via drill 0.35)  (3 unrouted)
  Top 0.152: U4.3 13.61,21.23 13.61,19.71 13.16,19.25 U4.29 | v32.11,11.18 32.41,11.48 32.55,11.48 32.81,11.74 U7.35
  Top 0.762: J3.2 20.73,22.91
  Bottom 0.152: U9.7 30.93,15.4 U9.9 | U5.5 7.53,11.72 v7.67,11.58
  Bottom 0.254: U1.21 21.56,8.77 v21.69,8.64 | U1.27 22.85,8.12 v22.5,7.77 | U1.4 21.56,5.97 v21.69,6.1
  other vias: 7.67,15.6 7.67,14.33 7.67,10.36 7.37,7.62 7.37,6.4 22.5,6.1 20.88,6.1 20.07,6.1 22.5,6.91 21.69,6.91 20.88,6.91 20.07,6.91 21.69,7.77 20.88,7.77 20.07,7.77 22.5,8.64 20.88,8.64 20.07,8.64 13.11,18.64 33.43,19.66 23.52,12.6 12.24,14.33 6.05,13.06 16.97,8.59 16.66,6.2 4.22,5.64 5.03,4.83 5.89,4.01 2.64,7.11 2.59,8.64 3.71,11.13 2.08,13.21 2.08,14.73 5.64,16 13,1.52 7.67,1.12
  pour Top: 0,28.27 38.86,28.27 38.86,-0.05 0,-0.05 0,28.14
  pour Bottom (rank 2): 0,28.27 38.86,28.27 38.86,-0.05 0,-0.05
I2C1_SCL  (via drill 0.35)
  Top 0.152: U7.38 34.79,14.33 v33.68,14.33 | v17.78,19.09 16.29,17.6 16.29,17.15 16.2,17.06 v16.2,16.71
  Bottom 0.152: v33.68,14.33 32.79,14.33 32.69,14.43 28.5,14.43 23.84,19.09 v17.78,19.09 | v16.2,16.71 16.18,16.74 J7.4
I2C1_SDA  (via drill 0.35)
  Top 0.152: U7.37 34.51,13.52 v34.08,13.52 | v20.12,18.44 18.75,18.44 v17.12,16.82
  Bottom 0.152: v34.08,13.52 33.12,13.52 32.51,14.12 28.3,14.12 23.64,18.78 20.46,18.78 v20.12,18.44 | v17.12,16.82 17.12,17.77 J7.3
I2C2_SCL  (via drill 0.35)
  Top 0.152: v33.68,15.96 33.74,15.96 34.04,16.26 34.75,16.26 U7.42 36.99,16.31 R3.2
  Bottom 0.152: U8.6 31.75,18.84 31.55,18.64 31.55,16 31.65,15.9 U9.6 33.62,15.9 v33.68,15.96
I2C2_SDA  (via drill 0.35)
  Top 0.152: v33.73,16.82 v33.73,16.81 U7.43 36.51,16.81 37,17.3 R5.2
  Bottom 0.152: U8.5 32.2,19.36 32.77,19.36 33.73,18.39 v33.73,16.82 33.63,16.82 33.22,16.41 32.2,16.41 U9.5
LED  (via drill 0.35)  (1 unrouted)
  Top 0.152: v27.23,12.45 27.67,12.45 U7.25
  Bottom 0.152: 27.28,12.5 v27.23,12.45
N$1
  Bottom 0.254: U1.16 17.73,10.22 C16.2
N$2
  Top 0.152: X1.3 32.19,22.33 31.34,21.49 31.34,20.85 U7.5
N$3
  Bottom 0.254: U1.19 20.56,11.88 R8.1
N$4
  Top 0.152: U7.7 30.31,21.61 30.02,21.9 29.27,21.9 R1.1
N$5
  Bottom 0.152: R4.1 37.82,12.43 D3.C
N$6  (via drill 0.35)
  Top 0.152: U7.44 35.73,17.31 v35.79,17.37
  Bottom 0.152: v35.79,17.37 36.79,18.36 TP3.TP 36.96,20.69 R2.1
N$7  (via drill 0.35)
  Top 0.152: U4.5 12.66,22.19 v12.71,22.25
  Bottom 0.152: v12.71,22.25 12.51,22.46 J8.2
N$8  (via drill 0.35)
  Top 0.152: U4.4 13.16,21.89 v13.57,22.3
  Bottom 0.152: v13.57,22.3 13.16,22.72 J8.3
N$9
  Top 0.152: R6.1 10,20.03 10.11,19.91 10.77,19.91 U4.9
N$10
  Top 0.152: U4.6 12.16,22.95 C6.2
N$11
  Bottom 0.254: C14.1 17.53,4.31 U1.9
N$12
  Bottom 0.254: U1.18 20.06,10.88 19.1,11.84 19.1,12.4 R14.2
N$13
  Bottom 0.254: U1.6 20.56,3.11 R9.2
N$14  (via drill 0.35)
  Top 0.254: R13.2 21.13,11 v21.39,10.75
  Bottom 0.254: v21.39,10.75 21.06,10.42 U1.20
N$15
  Bottom 0.254: U1.26 24.8,8.62 C15.1 27.27,8.94 L2.P$1
N$16
  Bottom 0.254: U1.25 23.79,9.16 24.59,9.96 C15.2
N$17
  Bottom 0.254: R7.2 22.43,11.22 22.15,10.94 22.15,10.93 22.1,10.87 22.1,9.88 U1.22
N$18
  Bottom 0.254: R14.1 17.75,13.45 C24.1
N$19
  Bottom 0.254: U1.15 18.26,8.62 16.71,10.16 C16.1 14.75,12.99 L3.P$1
N$20
  Bottom 0.254: U1.10 17.7,6.12 16.51,4.93 | 16.51,4.93 C14.2 | 16.51,4.93 15.96,4.93 L1.P$2
N$23  (via drill 0.35)
  Top 0.254: v21.17,3.81 21.17,2.79 C17.2
  Bottom 0.254: U1.5 21.06,3.92 v21.17,3.81
N$24
  Top 0.152: X1.1 29.79,22.64 30.84,21.59 30.84,20.84 U7.6
N$26
  Bottom 0.254: R16.1 19.13,3.18 20.07,4.12 U1.7
N$27
  Bottom 0.254: R16.2 17.61,2.63 C22.2
N$28
  Bottom 0.254: U1.23 22.56,10.78 22.96,11.18 23.62,11.18 R15.2
N$29
  Bottom 0.254: R15.1 25.08,11.2 C23.1
P$1  (via drill 0.35)
  Top 0.152: 10.92,21.27 U4.7 11.66,22.07 v11.53,22.2 | 10.92,21.27 9.63,21.27 R6.2 | U4.8 10.78,21.13 10.92,21.27
  Bottom 0.152: v11.53,22.2 11.53,22.45 11.89,22.81 11.89,23.49 J8.1
PITCH1
  pour Bottom (no thermals): 4.37,7.11 5.59,7.11 5.79,6.91 6.55,6.81 6.55,6.71 6.1,6.65 5.94,6.6 5.38,6.65 4.42,6.65
PITCH2
  pour Bottom (no thermals): 4.47,8.08 5.44,8.08 6.25,7.32 6.4,7.32 6.4,7.21 5.94,7.21 5.69,7.67 4.47,7.67
PITCH3
  pour Bottom (no thermals): 6.81,10.77 4.78,10.77 3.86,9.91 3.86,8.64 3.91,8.59 5.33,8.59 5.33,10.52 6.2,10.52 6.3,10.67 6.81,10.67
ROLL1
  pour Bottom (no thermals): 6.76,11.28 6.25,11.33 5.28,12.29 5.28,13.31 3.96,13.31 3.91,13.26 3.91,12.24 5.03,11.13 6.25,11.13 6.76,11.18
ROLL2
  pour Bottom (no thermals): 4.52,14.33 5.89,14.38 6.45,14.73 6.71,14.73 6.76,14.68 6.76,14.63 6.71,14.58 6.45,14.58 6.2,14.33 6.2,14.17 5.89,13.87 4.52,13.87
ROLL3
  pour Bottom (no thermals): 6.71,15.24 6.25,15.24 6.15,15.34 4.42,15.34 4.37,15.29 4.37,14.94 4.42,14.88 6.1,14.88 6.3,15.09 6.65,15.09 6.71,15.09 6.71,15.19
TIM1_CH1N  (via drill 0.35)
  Top 0.152: v9.33,11.8 11.16,11.8 12.14,10.82 12.9,10.82 13.36,10.36 13.36,3.71 15.49,1.58 25.91,1.58 31.29,6.96 31.29,10.52 30.68,11.13 v30.02,11.13 | U7.26 28.31,11.29 v28.19,11.18
  Bottom 0.152: U5.8 9.2,11.72 v9.33,11.8 | v28.19,11.18 29.97,11.18 v30.02,11.13
TIM1_CH2N  (via drill 0.35)
  Top 0.152: U7.27 28.8,10.82 28.19,10.21 27.69,10.21 24.79,13.11 24.79,13.89 24.46,14.22 23.67,14.22 v23.57,14.32 | v10.41,14.93 10.62,15.14 17.27,15.14 18.49,16.36 19.41,16.36 19.65,16.11 v20.27,16.11
  Bottom 0.152: U2.10 10.21,14.69 v10.41,14.93 | v20.27,16.11 20.57,16.11 20.61,16.08 20.83,16.08 21.07,15.84 21.72,15.84 23.24,14.32 v23.57,14.32
TIM1_CH3N  (via drill 0.35)
  Top 0.152: v9.52,15.7 17.17,15.7 18.19,16.71 19.91,16.71 v20.17,16.97 | v24.23,13.66 24.23,12.9 27.23,9.91 28.35,9.91 29.31,10.87 U7.28
  Bottom 0.152: U2.8 8.64,15.7 v9.52,15.7 | v20.17,16.97 20.78,16.97 21.6,16.15 22.53,16.15 24.12,14.55 24.12,13.77 v24.23,13.66
TIM3_CH2  (via drill 0.35)
  Top 0.152: v9.78,10.7 9.96,10.52 12.78,10.52 13.06,10.24 13.06,3.58 15.37,1.27 26.03,1.27 31.85,7.09 v31.85,7.11 | U7.14 26.32,18.8 27.13,18.8 31.68,14.24 v31.68,13.39
  Bottom 0.152: v9.78,10.7 9.55,10.69 9.52,10.72 U5.10 | v31.68,13.39 33.39,11.68 33.5,11.68 33.83,11.36 33.83,10.9 33.17,10.24 33.17,7.7 32.98,7.51 32.24,7.51 v31.85,7.11
TIM3_CH3  (via drill 0.35)  (1 unrouted)
  Top 0.152: v9.8,6.1 12.45,3.45 12.45,3.33 15.12,0.66 26.29,0.66 31.36,5.73
  Bottom 0.152: U6.10 8.99,6.71 9.25,6.71 v9.8,6.1
TIM3_CH4  (via drill 0.35)  (1 unrouted)
  Top 0.152: v8.99,7.82 9.12,7.7 9.12,7.01 9.44,6.68 10.13,6.68 12.75,4.06 12.75,3.46 15.24,0.97 26.16,0.97 31.29,6.1
  Bottom 0.152: U6.8 8.34,7.77 v8.99,7.82
USART1_RX  (via drill 0.35)
  Top 0.152: U4.26 15.57,19.36 16.1,19.36 16.55,19.8 v16.55,19.96 20.05,19.96 v21.79,18.23 | U7.31 30.81,13.24 v30.82,13.26
  Bottom 0.152: J6.1 13.46,17.78 14.83,19.15 15.73,19.15 v16.55,19.96 | v30.82,13.26 30.26,13.82 28.14,13.82 23.74,18.23 v21.79,18.23
USART1_TX  (via drill 0.35)
  Top 0.152: U4.25 15.58,18.85 16.15,18.85 16.41,19.11 v16.64,19.11 16.67,19.11 17.22,19.66 19.76,19.66 20.93,18.49 v20.93,17.93 | U7.30 30.33,12.33 30.33,12.95 29.87,13.41 27.33,13.41 27.1,13.18 v26.62,13.18
  Bottom 0.152: J6.2 10.66,16.82 11.12,16.36 13.06,16.36 15.54,18.85 16.38,18.85 v16.64,19.11 | v20.93,17.93 21.3,17.93 21.56,17.67 23.86,17.67 26.62,14.91 v26.62,13.18
V_BATT  (via drill 0.35)
  Top 0.152: R17.1 24.94,21.59 23.27,23.27
  Top 0.762: J3.1 23.27,23.27 23.27,22.05 22.71,21.49 22.71,13 22.66,12.96 22.66,12.24 23.16,11.74 23.21,11.74 23.9,11.05 | v25.35,7.72 25.65,8.03 25.65,9.3 23.9,11.05 | v25.96,8.08 25.96,7.87 v26.36,7.47 | 23.9,11.05 22.55,9.7 19.51,9.7 17.12,7.32 15.29,7.32 15.29,7.37 v14.94,7.72 | v15.65,7.72 15.7,7.66 v16.4,7.72
  Bottom 0.254: C13.2 25.61,7.12 U1.29 U1.28 | v16.4,7.72 16.45,7.67 18.14,7.62 U1.13 U1.12 16.41,7.12 15.85,6.55 15.33,6.55 C18.2
  Bottom 0.762: v25.35,7.72 25.6,7.72 v25.96,8.08 | v26.36,7.47 26.15,7.47 C13.2 | 15.49,7.72 v14.94,7.72 | 15.49,7.72 v15.65,7.72 | C18.2 15.28,7.51 15.49,7.72 | v16.4,7.72 C1.2
VCC_MEASURE
  Top 0.152: R18.1 25.86,20.12 R17.2 27.08,20.27 27.53,19.81 28.5,19.81 28.81,20.12 U7.10